# Altium schematic sheet Receiver.SchDoc
size A4
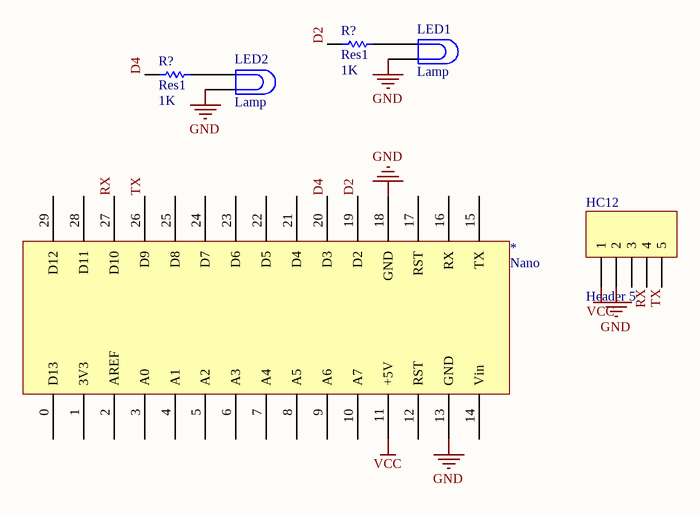
[diagram p0: Receiver.SchDoc]

## Parts
(Parts that share a designator on the sheet are numbered #1, #2 ... from top to bottom, then left to right.)
*  Nano  [ArduinoNano]
HC12  Header 5  [HDR1X5]
LED1  Lamp  [PIN2]
LED2  Lamp  [PIN2]
R?#1  Res1  value 1K  [AXIAL-0.3]
R?#2  Res1  value 1K  [AXIAL-0.3]

## Nets
GND: *.13(GND) *.18(GND) HC12.2 LED1.2 LED2.2
VCC: *.11(+5V) HC12.1
D2: *.19(D2) R?#1.1
D4: *.20(D3) R?#2.1
RX: *.27(D10) HC12.3
TX: *.26(D9) HC12.4
NetLED1_1: LED1.1 R?#1.2
NetLED2_1: LED2.1 R?#2.2

Not connected (* = marked no-connect by the designer): * 0(D13) 1(3V3) 2(AREF) 3(A0) 4(A1) 5(A2) 6(A3) 7(A4) 8(A5) 9(A6) 10(A7) 12(RST) 14(Vin) 15(TX) 16(RX) 17(RST) 21(D4) 22(D5) 23(D6) 24(D7) 25(D8) 28(D11) 29(D12); HC12 5

## Library data of the parts
* = Component_1
HC12 = Header 5: Header, 5-Pin; LatestRevisionDate: 17-Jul-2002; LatestRevisionNote: Re-released for DXP Platform.; Publisher: Altium Limited
LED1 LED2 = Lamp: Incandescent Bulb; Published: 24-Mar-1999; LatestRevisionDate: 17-Jul-2002; LatestRevisionNote: Re-released for DXP Platform.; PackageReference: PIN2; Publisher: Altium Limited
R?#1 R?#2 = Res1: Resistor; Published: 8-Jun-2000; LatestRevisionDate: 17-Jul-2002; LatestRevisionNote: Re-released for DXP Platform.; PackageReference: AXIAL-0.3; Publisher: Altium Limited; PackageDescription: Axial Device, Thru-Hole; 2 Leads; 0.3 in Pin Spacing